# EAGLE design qfp100 (EAGLE 6.4)
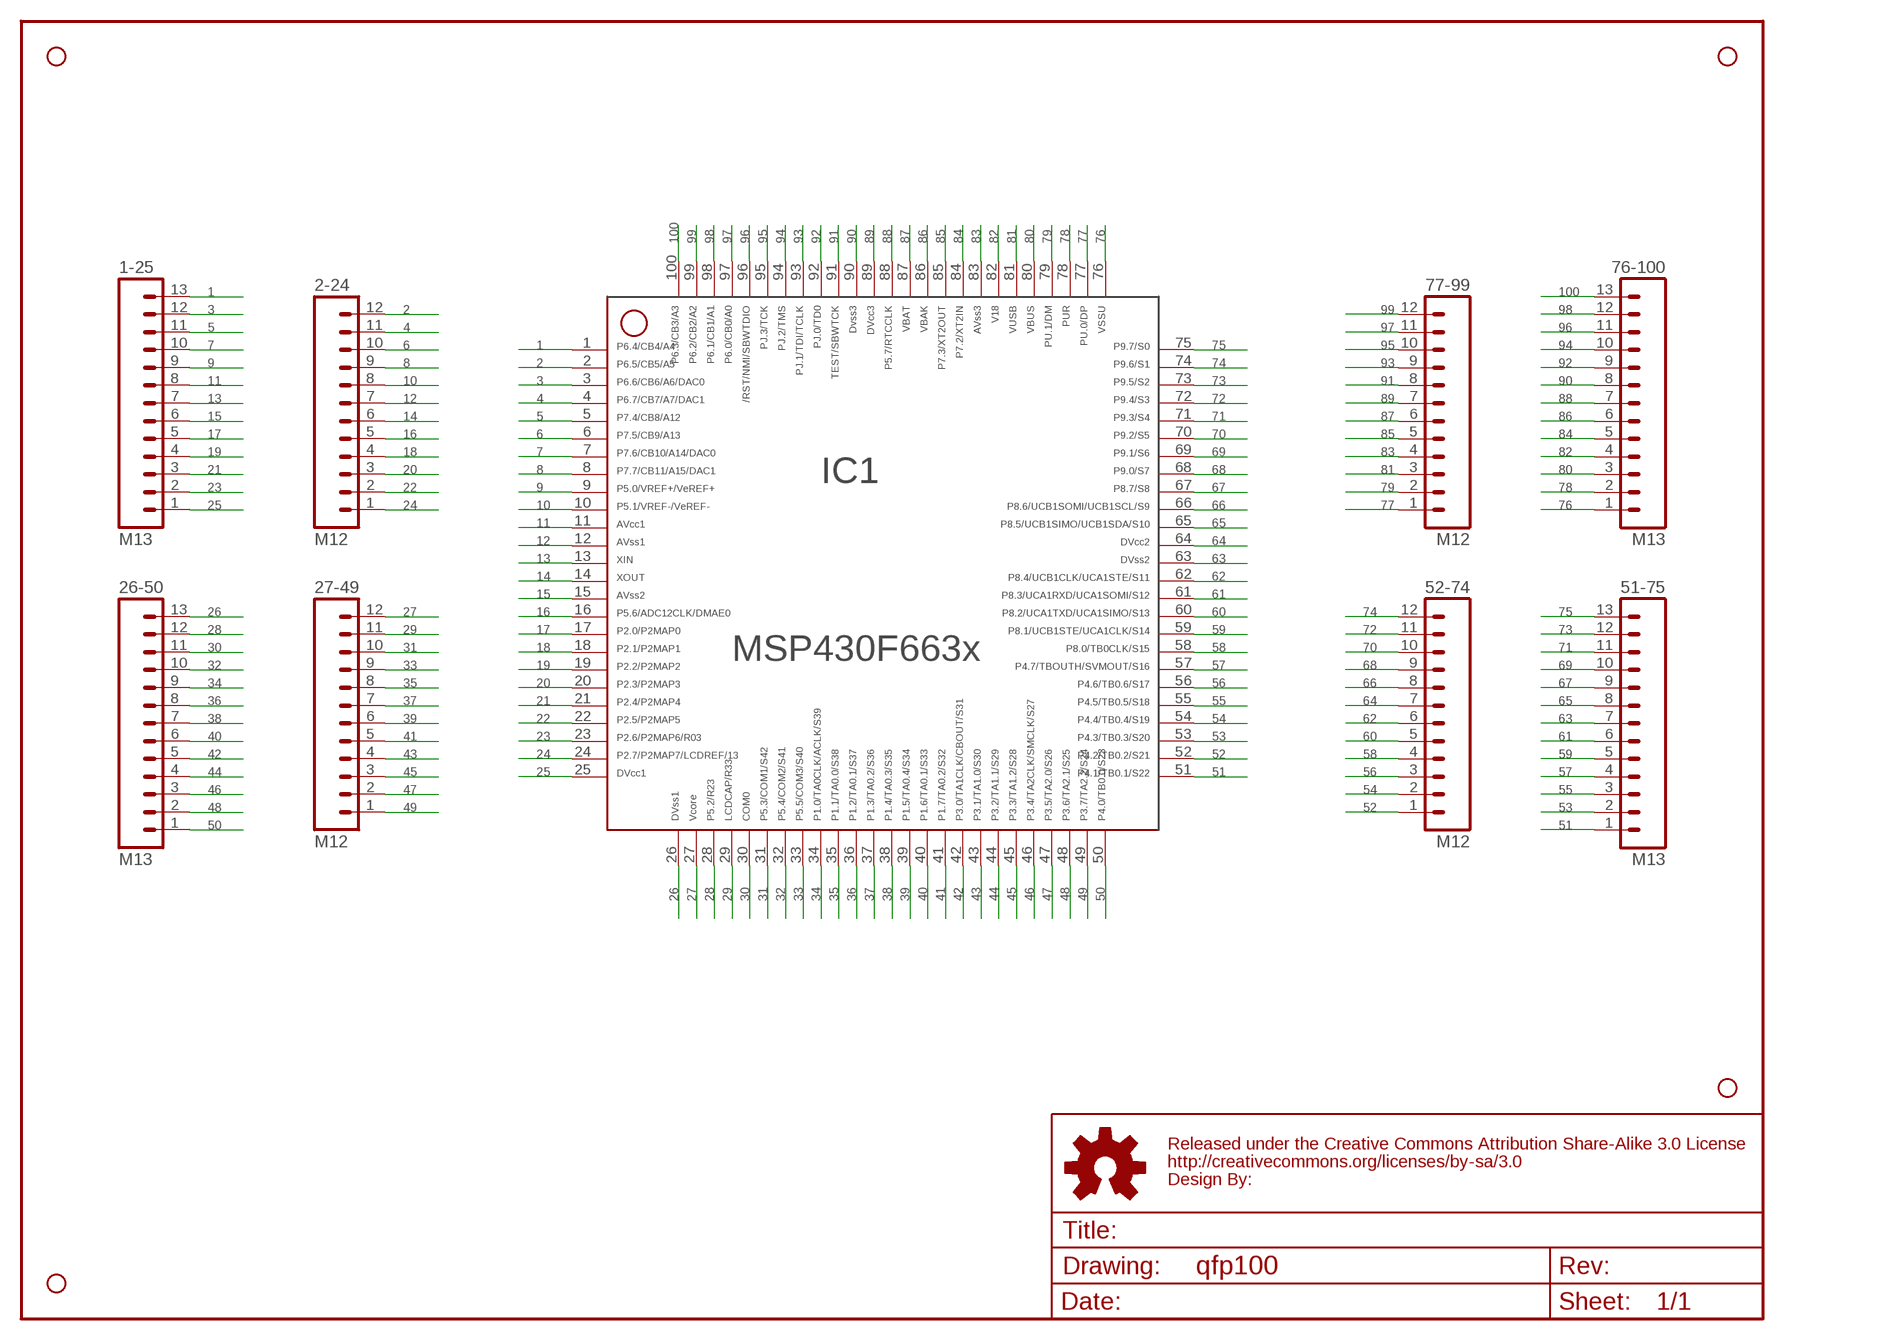
[diagram p0: schematic, sheet 1]

## Parts
1-25  M13  [1X13]
2-24  M12  M12PTH  [1X12]
26-50  M13  [1X13]
27-49  M12  M12PTH  [1X12]
51-75  M13  [1X13]
52-74  M12  M12PTH  [1X12]
76-100  M13  [1X13]
77-99  M12  M12PTH  [1X12]
FRAME1  FRAME-LETTER  [CREATIVE_COMMONS]
IC1  F66XX---PZ100EXTENDED  [PZ100-EXTENDED]
JP1  STAND-OFF  [STAND-OFF]
JP2  STAND-OFF  [STAND-OFF]
JP3  STAND-OFF  [STAND-OFF]
JP4  STAND-OFF  [STAND-OFF]

## Nets
1: 1-25.13 IC1.1
2: 2-24.12 IC1.2
3: 1-25.12 IC1.3
4: 2-24.11 IC1.4
5: 1-25.11 IC1.5
6: 2-24.10 IC1.6
7: 1-25.10 IC1.7
8: 2-24.9 IC1.8
9: 1-25.9 IC1.9
10: 2-24.8 IC1.10
11: 1-25.8 IC1.11
12: 2-24.7 IC1.12
13: 1-25.7 IC1.13
14: 2-24.6 IC1.14
15: 1-25.6 IC1.15
16: 2-24.5 IC1.16
17: 1-25.5 IC1.17
18: 2-24.4 IC1.18
19: 1-25.4 IC1.19
20: 2-24.3 IC1.20
21: 1-25.3 IC1.21
22: 2-24.2 IC1.22
23: 1-25.2 IC1.23
24: 2-24.1 IC1.24
25: 1-25.1 IC1.25
26: 26-50.13 IC1.26
27: 27-49.12 IC1.27
28: 26-50.12 IC1.28
29: 27-49.11 IC1.29
30: 26-50.11 IC1.30
31: 27-49.10 IC1.31
32: 26-50.10 IC1.32
33: 27-49.9 IC1.33
34: 26-50.9 IC1.34
35: 27-49.8 IC1.35
36: 26-50.8 IC1.36
37: 27-49.7 IC1.37
38: 26-50.7 IC1.38
39: 27-49.6 IC1.39
40: 26-50.6 IC1.40
41: 27-49.5 IC1.41
42: 26-50.5 IC1.42
43: 27-49.4 IC1.43
44: 26-50.4 IC1.44
45: 27-49.3 IC1.45
46: 26-50.3 IC1.46
47: 27-49.2 IC1.47
48: 26-50.2 IC1.48
49: 27-49.1 IC1.49
50: 26-50.1 IC1.50
51: 51-75.1 IC1.51
52: 52-74.1 IC1.52
53: 51-75.2 IC1.53
54: 52-74.2 IC1.54
55: 51-75.3 IC1.55
56: 52-74.3 IC1.56
57: 51-75.4 IC1.57
58: 52-74.4 IC1.58
59: 51-75.5 IC1.59
60: 52-74.5 IC1.60
61: 51-75.6 IC1.61
62: 52-74.6 IC1.62
63: 51-75.7 IC1.63
64: 52-74.7 IC1.64
65: 51-75.8 IC1.65
66: 52-74.8 IC1.66
67: 51-75.9 IC1.67
68: 52-74.9 IC1.68
69: 51-75.10 IC1.69
70: 52-74.10 IC1.70
71: 51-75.11 IC1.71
72: 52-74.11 IC1.72
73: 51-75.12 IC1.73
74: 52-74.12 IC1.74
75: 51-75.13 IC1.75
76: 76-100.1 IC1.76
77: 77-99.1 IC1.77
78: 76-100.2 IC1.78
79: 77-99.2 IC1.79
80: 76-100.3 IC1.80
81: 77-99.3 IC1.81
82: 76-100.4 IC1.82
83: 77-99.4 IC1.83
84: 76-100.5 IC1.84
85: 77-99.5 IC1.85
86: 76-100.6 IC1.86
87: 77-99.6 IC1.87
88: 76-100.7 IC1.88
89: 77-99.7 IC1.89
90: 76-100.8 IC1.90
91: 77-99.8 IC1.91
92: 76-100.9 IC1.92
93: 77-99.9 IC1.93
94: 76-100.10 IC1.94
95: 77-99.10 IC1.95
96: 76-100.11 IC1.96
97: 77-99.11 IC1.97
98: 76-100.12 IC1.98
99: 77-99.12 IC1.99
100: 76-100.13 IC1.100

## Library data of the parts
1-25 26-50 51-75 76-100 = SparkFun:M13
2-24 27-49 52-74 77-99 = SparkFun:M12: Header 12 Standard 12-pin 0.1" header. Use with straight break away headers (SKU : PRT-00116), right angle break away headers (PRT-00553), swiss pins (PRT-00743), machine pins (PRT-00117), and female headers (PRT-00115).
FRAME1 = SparkFun-Aesthetics:FRAME-LETTER: Schematic Frame Standard 8.5x11 US Letter frame; DESIGNER: Jacob McDonald; REV: 1; TITLE: LQFP 16-100 Pin Breakout
IC1 = TI_MSP430_v16:F66XX---PZ100: ***MSP430F66XX***PZ64 Rev 1.0 *** 06/2010
JP1-JP4 = SparkFun:STAND-OFF: Stand Off This is the mechanical footprint for a #4 phillips button head screw. Use the keepout ring to avoid running the screw head into surrounding components. SKU : PRT-00447

## Board
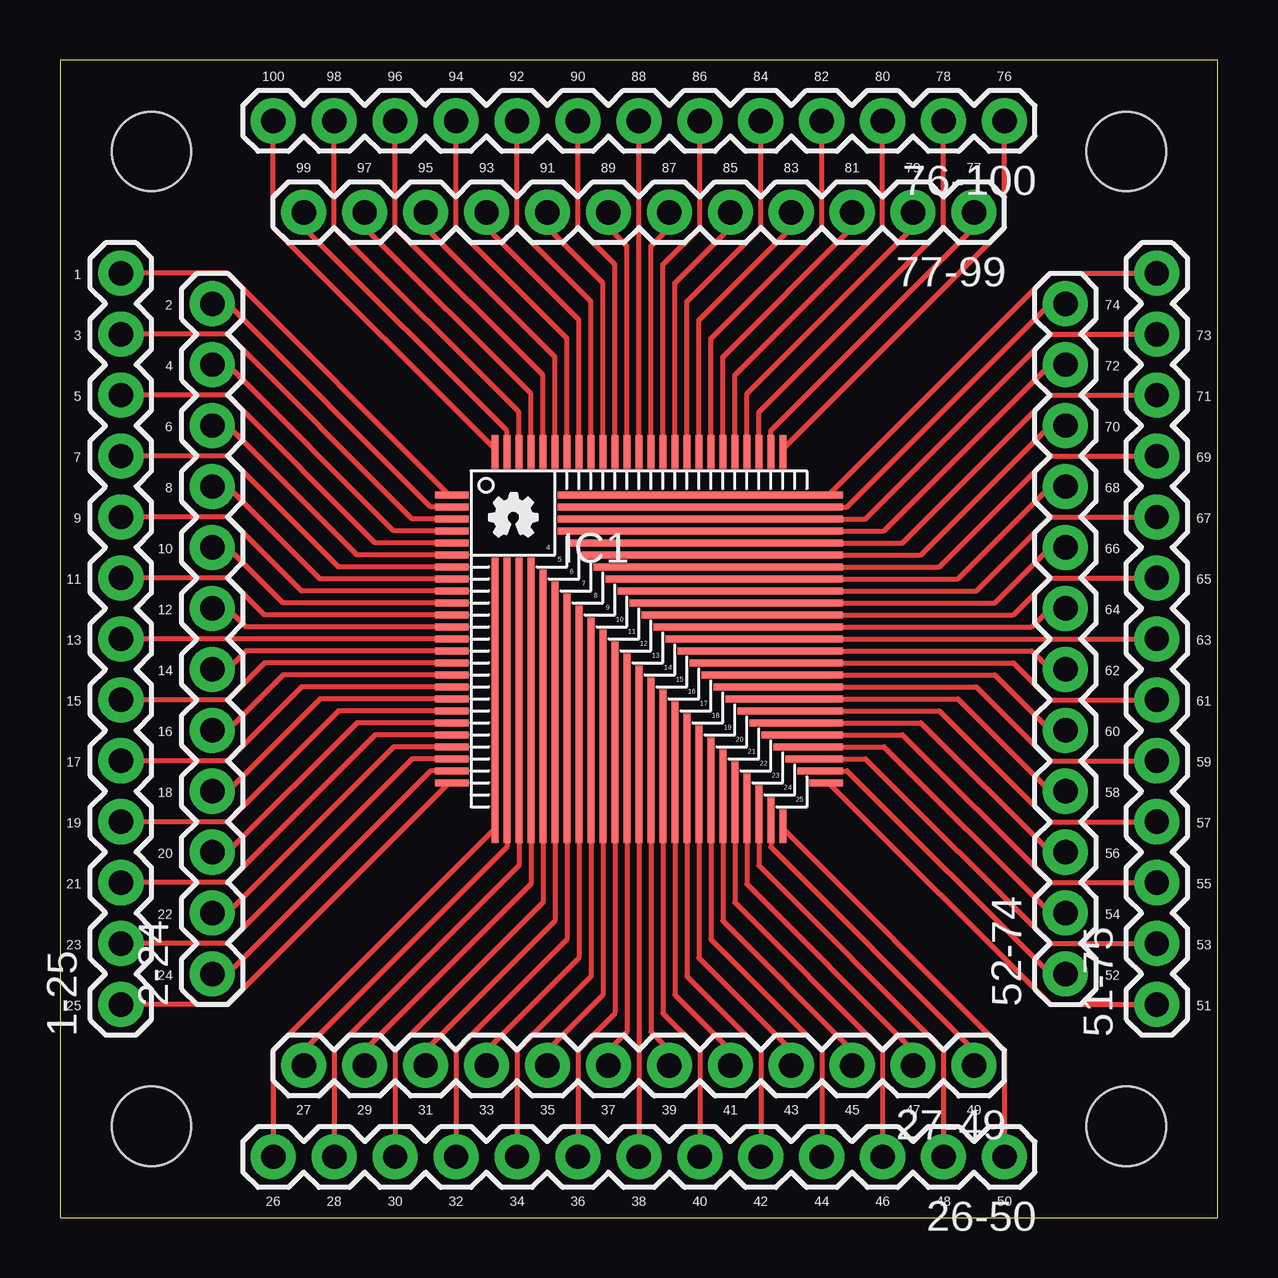
[diagram p1: board, top side]

Size 48.26 x 48.26 mm. Coordinates in mm from the lower left corner, seen from the top.
Outline: 0,0 48.26,0 48.26,48.26 0,48.26 0,0
Copper layers (1*16): Top 0.035mm / dielectric 1.5mm / Bottom 0.035mm
Design rules "default *": minimum track width 5mil, minimum drill 24mil, track to track 6mil, track to pad 6mil, pad to pad 6mil, via to via 6mil, smd to smd 6mil, copper to edge 40mil, drill to drill 8mil, minimum pad ring 10mil, minimum via ring 8mil, stop-mask expansion 0.03048125mm, vias tented up to drill 0mil, thermal gap 10mil

### Footprints (pad centres in the part's own frame; a part is rotated, then mirrored left to right if it is on the bottom)
1X13 = drill 1.016 pad 1.88: 1 0,0; 2 2.54,0; 3 5.08,0; 4 7.62,0; 5 10.16,0; 6 12.7,0; 7 15.24,0; 8 17.78,0; 9 20.32,0; 10 22.86,0; 11 25.4,0; 12 27.94,0; 13 30.48,0
1X12 = drill 1.016 pad 1.88: 1 0,0; 2 2.54,0; 3 5.08,0; 4 7.62,0; 5 10.16,0; 6 12.7,0; 7 15.24,0; 8 17.78,0; 9 20.32,0; 10 22.86,0; 11 25.4,0; 12 27.94,0
PZ100-EXTENDED = smd 1.4 x 0.3: 1 -7.8,6; 2 -7.8,5.5; 3 -7.8,5; 4 -7.8,4.5; 5 -7.8,4; 6 -7.8,3.5; 7 -7.8,3; 8 -7.8,2.5; 9 -7.8,2; 10 -7.8,1.5; 11 -7.8,1; 12 -7.8,0.5; 13 -7.8,0; 14 -7.8,-0.5; 15 -7.8,-1; 16 -7.8,-1.5; 17 -7.8,-2; 18 -7.8,-2.5; 19 -7.8,-3; 20 -7.8,-3.5; 21 -7.8,-4; 22 -7.8,-4.5; 23 -7.8,-5; 24 -7.8,-5.5; 25 -7.8,-6; 51 7.8,-6 | smd 0.3 x 11.9: 26 -6,-2.55; 27 -5.5,-2.55; 28 -5,-2.55; 29 -4.5,-2.55 | smd 0.3 x 11.4: 30 -4,-2.8 | smd 0.3 x 10.9: 31 -3.5,-3.05 | smd 0.3 x 10.4: 32 -3,-3.3 | smd 0.3 x 9.9: 33 -2.5,-3.55 | smd 0.3 x 9.4: 34 -2,-3.8 | smd 0.3 x 8.9: 35 -1.5,-4.05 | smd 0.3 x 8.4: 36 -1,-4.3 | smd 0.3 x 7.9: 37 -0.5,-4.55 | smd 0.3 x 7.4: 38 0,-4.8 | smd 0.3 x 6.9: 39 0.5,-5.05 | smd 0.3 x 6.4: 40 1,-5.3 | smd 0.3 x 5.9: 41 1.5,-5.55 | smd 0.3 x 5.4: 42 2,-5.8 | smd 0.3 x 4.9: 43 2.5,-6.05 | smd 0.3 x 4.4: 44 3,-6.3 | smd 0.3 x 3.9: 45 3.5,-6.55 | smd 0.3 x 3.4: 46 4,-6.8 | smd 0.3 x 2.9: 47 4.5,-7.05 | smd 0.3 x 2.4: 48 5,-7.3 | smd 0.3 x 1.9: 49 5.5,-7.55 | smd 0.3 x 1.4: 50 6,-7.8; 76 6,7.8; 77 5.5,7.8; 78 5,7.8; 79 4.5,7.8; 80 4,7.8; 81 3.5,7.8; 82 3,7.8; 83 2.5,7.8; 84 2,7.8; 85 1.5,7.8; 86 1,7.8; 87 0.5,7.8; 88 0,7.8; 89 -0.5,7.8; 90 -1,7.8; 91 -1.5,7.8; 92 -2,7.8; 93 -2.5,7.8; 94 -3,7.8; 95 -3.5,7.8; 96 -4,7.8; 97 -4.5,7.8; 98 -5,7.8; 99 -5.5,7.8; 100 -6,7.8 | smd 1.9 x 0.3: 52 7.55,-5.5 | smd 2.4 x 0.3: 53 7.3,-5 | smd 2.9 x 0.3: 54 7.05,-4.5 | smd 3.4 x 0.3: 55 6.8,-4 | smd 3.9 x 0.3: 56 6.55,-3.5 | smd 4.4 x 0.3: 57 6.3,-3 | smd 4.9 x 0.3: 58 6.05,-2.5 | smd 5.4 x 0.3: 59 5.8,-2 | smd 5.9 x 0.3: 60 5.55,-1.5 | smd 6.4 x 0.3: 61 5.3,-1 | smd 6.9 x 0.3: 62 5.05,-0.5 | smd 7.4 x 0.3: 63 4.8,0 | smd 7.9 x 0.3: 64 4.55,0.5 | smd 8.4 x 0.3: 65 4.3,1 | smd 8.9 x 0.3: 66 4.05,1.5 | smd 9.4 x 0.3: 67 3.8,2 | smd 9.9 x 0.3: 68 3.55,2.5 | smd 10.4 x 0.3: 69 3.3,3 | smd 10.9 x 0.3: 70 3.05,3.5 | smd 11.4 x 0.3: 71 2.8,4 | smd 11.9 x 0.3: 72 2.55,4.5; 73 2.55,5; 74 2.55,5.5; 75 2.55,6
STAND-OFF = hole 3.302: 0,0

### Placement (x,y rotation side)
1-25  2.54,8.89 90 top
2-24  6.35,10.16 90 top
26-50  39.37,2.54 180 top
27-49  38.1,6.35 180 top
51-75  45.72,8.89 90 top
52-74  41.91,10.16 90 top
76-100  39.37,45.72 180 top
77-99  38.1,41.91 180 top
FRAME1  21.59,-7.62 0 top  (outside the outline)
IC1  24.13,24.13 0 top
JP1  3.81,44.45 0 top
JP2  3.81,3.81 0 top
JP3  44.45,3.81 0 top
JP4  44.45,44.45 0 top
U$1  [OSHW-LOGO-XS]  18.9,29.2 0 top

### Tracks (layer width: path | path; a pad name or v marks a point on that pad's centre or on a via)
1
  Top 0.203: IC1.1 16.23,30.13 6.99,39.37 1-25.13
2
  Top 0.203: IC1.2 15.46,29.63 6.99,38.1 2-24.12
3
  Top 0.203: IC1.3 14.69,29.13 6.99,36.83 1-25.12
4
  Top 0.203: IC1.4 13.91,28.63 6.99,35.56 2-24.11
5
  Top 0.203: IC1.5 13.14,28.13 6.99,34.29 1-25.11
6
  Top 0.203: IC1.6 12.38,27.63 6.99,33.02 2-24.10
7
  Top 0.203: IC1.7 11.61,27.13 6.99,31.75 1-25.10
8
  Top 0.203: IC1.8 10.84,26.63 6.99,30.48 2-24.9
9
  Top 0.203: IC1.9 10.06,26.13 6.99,29.21 1-25.9
10
  Top 0.203: IC1.10 9.29,25.63 6.99,27.94 2-24.8
11
  Top 0.203: IC1.11 8.53,25.13 6.99,26.67 1-25.8
12
  Top 0.203: IC1.12 7.75,24.63 6.99,25.4 2-24.7
13
  Top 0.203: IC1.13 1-25.7
14
  Top 0.203: IC1.14 7.75,23.63 6.99,22.86 2-24.6
15
  Top 0.203: IC1.15 8.53,23.13 6.99,21.59 1-25.6
16
  Top 0.203: IC1.16 9.29,22.63 6.99,20.32 2-24.5
17
  Top 0.203: IC1.17 10.06,22.13 6.99,19.05 1-25.5
18
  Top 0.203: IC1.18 10.84,21.63 6.99,17.78 2-24.4
19
  Top 0.203: 1-25.4 6.99,16.51 11.61,21.13 IC1.19
20
  Top 0.203: IC1.20 12.38,20.63 6.99,15.24 2-24.3
21
  Top 0.203: IC1.21 13.14,20.13 6.99,13.97 1-25.3
22
  Top 0.203: IC1.22 13.91,19.63 6.99,12.7 2-24.2
23
  Top 0.203: IC1.23 14.69,19.13 6.99,11.43 1-25.2
24
  Top 0.203: IC1.24 15.46,18.63 6.99,10.16 2-24.1
25
  Top 0.203: IC1.25 16.23,18.13 6.99,8.89 1-25.1
26
  Top 0.203: IC1.26 18.13,16.23 8.89,6.99 26-50.13
27
  Top 0.203: IC1.27 18.63,15.46 10.16,6.99 27-49.12
28
  Top 0.203: IC1.28 19.13,14.69 11.43,6.99 26-50.12
29
  Top 0.203: IC1.29 19.63,13.91 12.7,6.99 27-49.11
30
  Top 0.203: IC1.30 20.13,13.14 13.97,6.99 26-50.11
31
  Top 0.203: IC1.31 20.63,12.38 15.24,6.99 27-49.10
32
  Top 0.203: IC1.32 21.13,11.61 16.51,6.99 26-50.10
33
  Top 0.203: IC1.33 21.63,10.84 17.78,6.99 27-49.9
34
  Top 0.203: IC1.34 22.13,10.06 19.05,6.99 26-50.9
35
  Top 0.203: IC1.35 22.63,9.29 20.32,6.99 27-49.8
36
  Top 0.203: IC1.36 23.13,8.53 21.59,6.99 26-50.8
37
  Top 0.203: IC1.37 23.63,7.75 22.86,6.99 27-49.7
38
  Top 0.203: IC1.38 26-50.7
39
  Top 0.203: IC1.39 24.63,7.75 25.4,6.99 27-49.6
40
  Top 0.203: IC1.40 25.13,8.53 26.67,6.99 26-50.6
41
  Top 0.203: IC1.41 25.63,9.29 27.94,6.99 27-49.5
42
  Top 0.203: IC1.42 26.13,10.06 29.21,6.99 26-50.5
43
  Top 0.203: IC1.43 26.63,10.84 30.48,6.99 27-49.4
44
  Top 0.203: IC1.44 27.13,11.61 31.75,6.99 26-50.4
45
  Top 0.203: IC1.45 27.63,12.38 33.02,6.99 27-49.3
46
  Top 0.203: IC1.46 28.13,13.14 34.29,6.99 26-50.3
47
  Top 0.203: IC1.47 28.63,13.91 35.56,6.99 27-49.2
48
  Top 0.203: IC1.48 29.13,14.69 36.83,6.99 26-50.2
49
  Top 0.203: IC1.49 29.63,15.46 38.1,6.99 27-49.1
50
  Top 0.203: IC1.50 30.13,16.23 39.37,6.99 26-50.1
51
  Top 0.203: IC1.51 32.03,18.13 41.27,8.89 51-75.1
52
  Top 0.203: IC1.52 32.8,18.63 41.27,10.16 52-74.1
53
  Top 0.203: IC1.53 33.58,19.13 41.27,11.43 51-75.2
54
  Top 0.203: IC1.54 34.34,19.63 41.27,12.7 52-74.2
55
  Top 0.203: IC1.55 35.12,20.13 41.27,13.97 51-75.3
56
  Top 0.203: IC1.56 35.88,20.63 41.27,15.24 52-74.3
57
  Top 0.203: IC1.57 36.66,21.13 41.27,16.51 51-75.4
58
  Top 0.203: IC1.58 37.42,21.63 41.27,17.78 52-74.4
59
  Top 0.203: IC1.59 38.2,22.13 41.27,19.05 51-75.5
60
  Top 0.203: IC1.60 38.97,22.63 41.27,20.32 52-74.5
61
  Top 0.203: IC1.61 39.73,23.13 41.27,21.59 51-75.6
62
  Top 0.203: IC1.62 40.51,23.63 41.27,22.86 52-74.6
63
  Top 0.203: IC1.63 51-75.7
64
  Top 0.203: IC1.64 40.51,24.63 41.27,25.4 52-74.7
65
  Top 0.203: IC1.65 39.73,25.13 41.27,26.67 51-75.8
66
  Top 0.203: IC1.66 38.97,25.63 41.27,27.94 52-74.8
67
  Top 0.203: IC1.67 38.2,26.13 41.27,29.21 51-75.9
68
  Top 0.203: IC1.68 37.42,26.63 41.27,30.48 52-74.9
69
  Top 0.203: IC1.69 36.66,27.13 41.27,31.75 51-75.10
70
  Top 0.203: IC1.70 35.88,27.63 41.27,33.02 52-74.10
71
  Top 0.203: IC1.71 35.12,28.13 41.27,34.29 51-75.11
72
  Top 0.203: IC1.72 34.34,28.63 41.27,35.56 52-74.11
73
  Top 0.203: IC1.73 33.58,29.13 41.27,36.83 51-75.12
74
  Top 0.203: IC1.74 32.8,29.63 41.27,38.1 52-74.12
75
  Top 0.203: IC1.75 32.03,30.13 41.27,39.37 51-75.13
76
  Top 0.203: IC1.76 30.13,32.03 39.37,41.27 76-100.1
77
  Top 0.203: IC1.77 29.63,32.8 38.1,41.27 77-99.1
78
  Top 0.203: IC1.78 29.13,33.58 36.83,41.27 76-100.2
79
  Top 0.203: IC1.79 28.63,34.34 35.56,41.27 77-99.2
80
  Top 0.203: IC1.80 28.13,35.12 34.29,41.27 76-100.3
81
  Top 0.203: IC1.81 27.63,35.88 33.02,41.27 77-99.3
82
  Top 0.203: IC1.82 27.13,36.66 31.75,41.27 76-100.4
83
  Top 0.203: IC1.83 26.63,37.42 30.48,41.27 77-99.4
84
  Top 0.203: IC1.84 26.13,38.2 29.21,41.27 76-100.5
85
  Top 0.203: IC1.85 25.63,38.97 27.94,41.27 77-99.5
86
  Top 0.203: IC1.86 25.13,39.73 26.67,41.27 76-100.6
87
  Top 0.203: IC1.87 24.63,40.51 25.4,41.27 77-99.6
88
  Top 0.203: IC1.88 76-100.7
89
  Top 0.203: IC1.89 23.63,40.51 22.86,41.27 77-99.7
90
  Top 0.203: IC1.90 23.13,39.73 21.59,41.27 76-100.8
91
  Top 0.203: IC1.91 22.63,38.97 20.32,41.27 77-99.8
92
  Top 0.203: IC1.92 22.13,38.2 19.05,41.27 76-100.9
93
  Top 0.203: IC1.93 21.63,37.42 17.78,41.27 77-99.9
94
  Top 0.203: IC1.94 21.13,36.66 16.51,41.27 76-100.10
95
  Top 0.203: IC1.95 20.63,35.88 15.24,41.27 77-99.10
96
  Top 0.203: IC1.96 20.13,35.12 13.97,41.27 76-100.11
97
  Top 0.203: IC1.97 19.63,34.34 12.7,41.27 77-99.11
98
  Top 0.203: IC1.98 19.13,33.58 11.43,41.27 76-100.12
99
  Top 0.203: IC1.99 18.63,32.8 10.16,41.27 77-99.12
100
  Top 0.203: IC1.100 18.13,32.03 8.89,41.27 76-100.13

### Text on the board
tPlace: 100 | 98 | 96 | 94 | 92 | 90 | 88 | 86 | 84 | 82 | 80 | 78 | 76 | 99 | 97 | 95 | 93 | 91 | 89 | 87 | 85 | 83 | 81 | 79 | 77 | 1 | 2 | 74 | 3 | 73 | 4 | 72 | 5 | 71 | 6 | 70 | 7 | 69 | 8 | 68 | 9 | 67 | 10 | 66 | 11 | 65 | 12 | 64 | 13 | 63 | 14 | 62 | 15 | 61 | 16 | 60 | 17 | 59 | 18 | 58 | 19 | 57 | 20 | 56 | 21 | 55 | 22 | 54 | 23 | 53 | 24 | 52 | 25 | 51 | 27 | 29 | 31 | 33 | 35 | 37 | 39 | 41 | 43 | 45 | 47 | 49 | 26 | 28 | 30 | 32 | 34 | 36 | 38 | 40 | 42 | 44 | 46 | 48 | 50
bDocu: 75